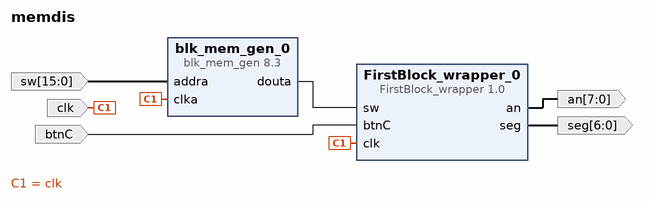
[diagram p0: block diagram of the top level]
# Vivado block design memdis, xc7a100tcsg324-1, Vivado 2016.4
create_bd_design memdis

create_bd_port -dir I -from 15 -to 0 sw
create_bd_port -dir I clk
create_bd_port -dir I btnC
create_bd_port -dir O -from 7 -to 0 an
create_bd_port -dir O -from 6 -to 0 seg

create_bd_cell -type ip -vlnv ua.pt:user:FirstBlock_wrapper:1.0 FirstBlock_wrapper_0
create_bd_cell -type ip -vlnv xilinx.com:ip:blk_mem_gen:8.3 blk_mem_gen_0
set_property -dict [list \
  CONFIG.Memory_Type Single_Port_ROM \
  CONFIG.Enable_32bit_Address false \
  CONFIG.Write_Width_A 16 \
  CONFIG.Enable_A Always_Enabled \
  CONFIG.Register_PortA_Output_of_Memory_Primitives false \
  CONFIG.Load_Init_File true \
  CONFIG.Coe_File ../../../../../../../../JAVA/mul.coe \
  CONFIG.Use_RSTA_Pin false \
  CONFIG.Port_A_Write_Rate 0 \
  CONFIG.use_bram_block Stand_Alone \
] [get_bd_cells blk_mem_gen_0]

# ---- connections ----

connect_bd_net [get_bd_pins blk_mem_gen_0/douta] [get_bd_pins FirstBlock_wrapper_0/sw]
connect_bd_net [get_bd_ports sw] [get_bd_pins blk_mem_gen_0/addra]
connect_bd_net [get_bd_ports clk] [get_bd_pins blk_mem_gen_0/clka] [get_bd_pins FirstBlock_wrapper_0/clk]
connect_bd_net [get_bd_ports btnC] [get_bd_pins FirstBlock_wrapper_0/btnC]
connect_bd_net [get_bd_pins FirstBlock_wrapper_0/an] [get_bd_ports an]
connect_bd_net [get_bd_pins FirstBlock_wrapper_0/seg] [get_bd_ports seg]

validate_bd_design
save_bd_design
